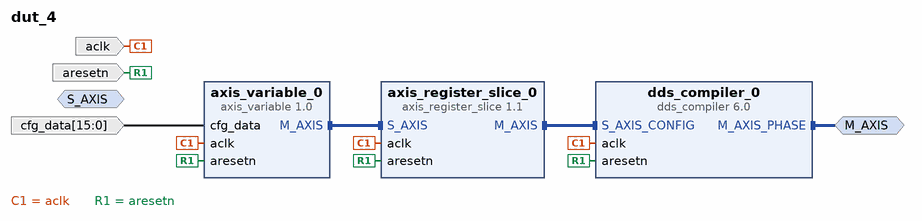
[diagram p0: block diagram of the top level]
# Vivado block design dut_4, Vivado 2015.4
create_bd_design dut_4

create_bd_intf_port -mode Slave -vlnv xilinx.com:interface:axis_rtl:1.0 S_AXIS
set_property -dict [list \
  CONFIG.TDATA_NUM_BYTES 4 \
  CONFIG.TDEST_WIDTH 0 \
  CONFIG.TID_WIDTH 0 \
  CONFIG.TUSER_WIDTH 0 \
  CONFIG.HAS_TREADY 1 \
  CONFIG.HAS_TSTRB 0 \
  CONFIG.HAS_TKEEP 0 \
  CONFIG.HAS_TLAST 0 \
  CONFIG.FREQ_HZ 100000000 \
  CONFIG.PHASE 0.000 \
  CONFIG.LAYERED_METADATA undef \
] [get_bd_intf_ports S_AXIS]
create_bd_intf_port -mode Master -vlnv xilinx.com:interface:axis_rtl:1.0 M_AXIS
create_bd_port -dir I -type rst aresetn
create_bd_port -dir I -type clk aclk
create_bd_port -dir I -from 15 -to 0 cfg_data

create_bd_cell -type ip -vlnv pavel-demin:user:axis_variable:1.0 axis_variable_0
set_property -dict {CONFIG.AXIS_TDATA_WIDTH 16} [get_bd_cells axis_variable_0]
create_bd_cell -type ip -vlnv xilinx.com:ip:dds_compiler:6.0 dds_compiler_0
set_property -dict [list \
  CONFIG.PartsPresent Phase_Generator_only \
  CONFIG.DDS_Clock_Rate 125 \
  CONFIG.Parameter_Entry Hardware_Parameters \
  CONFIG.Noise_Shaping None \
  CONFIG.Phase_Width 16 \
  CONFIG.Output_Width 3 \
  CONFIG.Phase_Increment Programmable \
  CONFIG.DSP48_Use Maximal \
  CONFIG.DATA_Has_TLAST Not_Required \
  CONFIG.Has_TREADY true \
  CONFIG.S_PHASE_Has_TUSER Not_Required \
  CONFIG.M_DATA_Has_TUSER Not_Required \
  CONFIG.Latency 8 \
  CONFIG.Has_ARESETn true \
  CONFIG.Output_Frequency1 0 \
  CONFIG.PINC1 0 \
] [get_bd_cells dds_compiler_0]
create_bd_cell -type ip -vlnv xilinx.com:ip:axis_register_slice:1.1 axis_register_slice_0

# ---- connections ----

connect_bd_intf_net [get_bd_intf_pins axis_variable_0/M_AXIS] [get_bd_intf_pins axis_register_slice_0/S_AXIS]
connect_bd_intf_net [get_bd_intf_pins axis_register_slice_0/M_AXIS] [get_bd_intf_pins dds_compiler_0/S_AXIS_CONFIG]
connect_bd_intf_net [get_bd_intf_ports M_AXIS] [get_bd_intf_pins dds_compiler_0/M_AXIS_PHASE]
connect_bd_net [get_bd_ports aclk] [get_bd_pins axis_variable_0/aclk] [get_bd_pins dds_compiler_0/aclk] [get_bd_pins axis_register_slice_0/aclk]
connect_bd_net [get_bd_ports aresetn] \
  [get_bd_pins axis_variable_0/aresetn] [get_bd_pins dds_compiler_0/aresetn] [get_bd_pins axis_register_slice_0/aresetn]
connect_bd_net [get_bd_ports cfg_data] [get_bd_pins axis_variable_0/cfg_data]

validate_bd_design
save_bd_design
